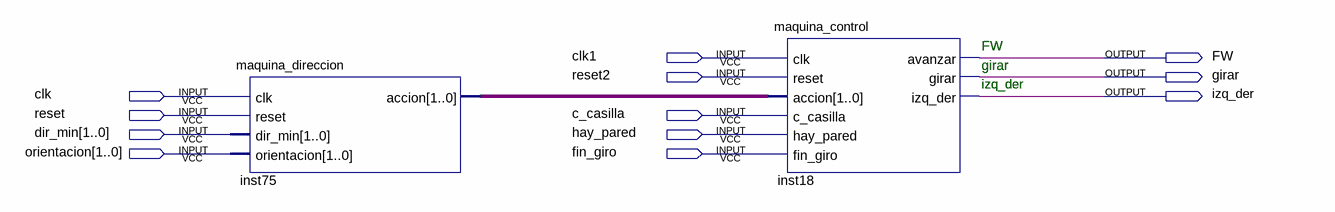
[diagram p0: schematic sheet]
// Quartus schematic prueba_control_v2.bdf as structural Verilog: 2 symbols, 12 pins
module prueba_control_v2 (
  input  clk1,
  input  reset2,
  input  clk,
  input  reset,
  input  c_casilla,
  input  [1:0] dir_min,
  input  hay_pared,
  input  [1:0] orientacion,
  input  fin_giro,
  output FW,
  output girar,
  output izq_der
);

  wire [1:0] inst75_accion;

  maquina_direccion inst75 (
    .clk(clk), .reset(reset), .dir_min(dir_min), .orientacion(orientacion), .accion(inst75_accion));
  maquina_control inst18 (
    .clk(clk1), .reset(reset2), .accion(inst75_accion), .c_casilla(c_casilla), .hay_pared(hay_pared),
    .fin_giro(fin_giro), .avanzar(FW), .girar(girar), .izq_der(izq_der));

  // Notes on the sheet:
  //   FW
  //   girar
  //   izq_der
endmodule
